# EAGLE design remoteserialcontroller (EAGLE 9.5.2)
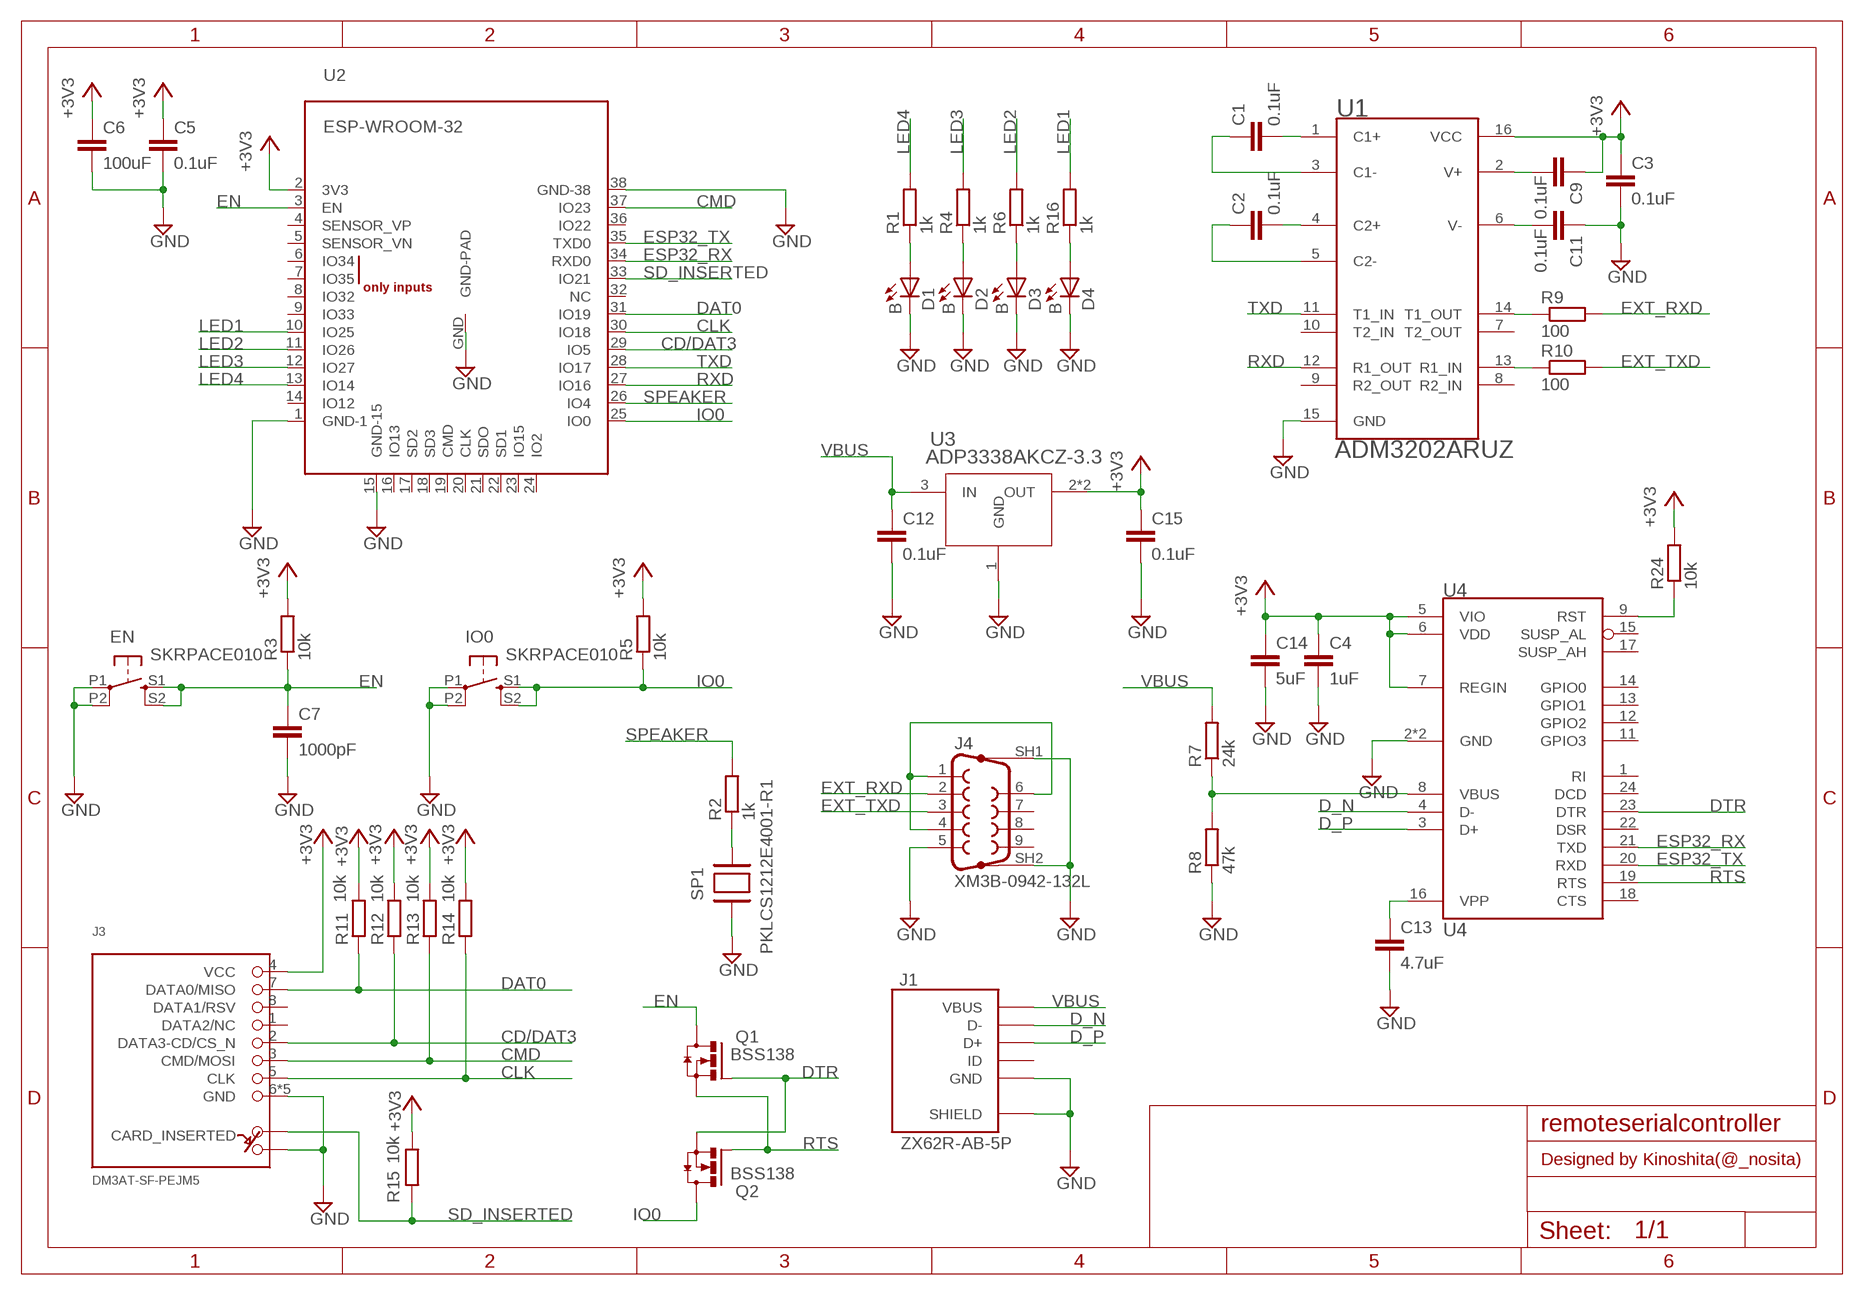
[diagram p0: schematic, sheet 1]

## Parts
C1  0.1uF  C-EUC0603  [C0603]
C2  0.1uF  C-EUC0603  [C0603]
C3  0.1uF  C-EUC0603  [C0603]
C4  1uF  C-EUC0603  [C0603]
C5  0.1uF  C-EUC0603  [C0603]
C6  100uF  C-EUC1210  [C1210]
C7  1000pF  C-EUC0603  [C0603]
C9  0.1uF  C-EUC0603  [C0603]
C11  0.1uF  C-EUC0603  [C0603]
C12  0.1uF  C-EUC0603  [C0603]
C13  4.7uF  C-EUC0603  [C0603]
C14  5uF  C-EUC0603  [C0603]
C15  0.1uF  C-EUC0603  [C0603]
D1  B  LEDCHIPLED_0603  [CHIPLED_0603]
D2  B  LEDCHIPLED_0603  [CHIPLED_0603]
D3  B  LEDCHIPLED_0603  [CHIPLED_0603]
D4  B  LEDCHIPLED_0603  [CHIPLED_0603]
EN  SKRPACE010  [SKRPACE010]
IO0  SKRPACE010  [SKRPACE010]
J1  ZX62R-AB-5P  [ZX62R-B-5PA]
J3  DM3AT-SF-PEJM5  [DM3AT-SF-PEJM5]
J4  XM3B-0942-132L  [XM3B-0942-132L]
Q1  BSS138  [SOT23-N-MOSFET]
Q2  BSS138  [SOT23-N-MOSFET]
R1  1k  R-EU_R0603  [R0603]
R2  1k  R-EU_R0603  [R0603]
R3  10k  R-EU_R0603  [R0603]
R4  1k  R-EU_R0603  [R0603]
R5  10k  R-EU_R0603  [R0603]
R6  1k  R-EU_R0603  [R0603]
R7  24k  R-EU_R0603  [R0603]
R8  47k  R-EU_R0603  [R0603]
R9  100  R-EU_R0603  [R0603]
R10  100  R-EU_R0603  [R0603]
R11  10k  R-EU_R0603  [R0603]
R12  10k  R-EU_R0603  [R0603]
R13  10k  R-EU_R0603  [R0603]
R14  10k  R-EU_R0603  [R0603]
R15  10k  R-EU_R0603  [R0603]
R16  1k  R-EU_R0603  [R0603]
R24  10k  R-EU_R0603  [R0603]
SP1  PKLCS1212E4001-R1  [PKLCS1212E4001-R1]
U1  ADM3202ARUZ  [TSSOP16-AD]
U2  ESP-WROOM-32  [ESP-WROOM-32]
U3  ADP3338AKCZ-3.3  [SOT233]
U4  CP2104  [QFN24-SILABS]

## Nets
+3V3 [POWER]: C3.1 C4.1 C5.1 C6.1 C9.1 C14.1 C15.1 J3.4(VCC) R3.2 R5.2 R11.2 R12.2 R13.2 R14.2 R15.2 R24.2 U1.16(VCC) U2.2(3V3) U3.2(OUT) U3.4(OUT) U4.5(VIO) U4.6(VDD) U4.7(REGIN)
CD/DAT3: J3.2(DATA3-CD/CS_N) R12.1 U2.29(IO5)
CLK: J3.5(CLK) R14.1 U2.30(IO18)
CMD: J3.3(CMD/MOSI) R13.1 U2.37(IO23)
D_N: J1.D- U4.4(D-)
D_P: J1.D+ U4.3(D+)
DAT0: J3.7(DATA0/MISO) R11.1 U2.31(IO19)
DTR: Q1.G Q2.S U4.23(DTR)
EN: C7.1 EN.S1(S) EN.S2(S1) Q1.D R3.1 U2.3(EN)
ESP32_RX: U2.34(RXD0) U4.21(TXD)
ESP32_TX: U2.35(TXD0) U4.20(RXD)
EXT_RXD: J4.2 R9.2
EXT_TXD: J4.3 R10.2
GND: C3.2 C4.2 C5.2 C6.2 C7.2 C11.1 C12.2 C13.2 C14.2 C15.2 D1.C D2.C D3.C D4.C EN.P1(P) EN.P2(P1) IO0.P1(P) IO0.P2(P1) J1.GND J1.SHIELD@1(SHIELD) J1.SHIELD@2(SHIELD) J1.SHIELD@3(SHIELD) J1.SHIELD@4(SHIELD) J3.6(GND) J3.B J3.MOUNT0(GND) J3.MOUNT1(GND) J3.MOUNT2(GND) J3.MOUNT3(GND) J4.5 J4.SH1(G1) J4.SH2(G2) R8.1 SP1.2 U1.15(GND) U2.1(GND-1) U2.15(GND-15) U2.38(GND-38) U2.GND(GND-PAD) U3.1(GND) U4.2(GND) U4.25(GND)
IO0: IO0.S1(S) IO0.S2(S1) Q2.D R5.1 U2.25(IO0)
LED1: R16.2 U2.10(IO25)
LED2: R6.2 U2.11(IO26)
LED3: R4.2 U2.12(IO27)
LED4: R1.2 U2.13(IO14)
N$1: J4.1 J4.4 J4.6
N$2: R9.1 U1.14(T1_OUT)
N$3: R10.1 U1.13(R1_IN)
N$4: D2.A R4.1
N$5: D3.A R6.1
N$6: D4.A R16.1
N$7: R24.1 U4.9(RST)
N$8: R7.1 R8.2 U4.8(VBUS)
N$9: C13.1 U4.16(VPP)
N$11: C1.2 U1.1(C1+)
N$13: C1.1 U1.3(C1-)
N$14: C2.2 U1.4(C2+)
N$15: C2.1 U1.5(C2-)
N$16: C9.2 U1.2(V+)
N$17: C11.2 U1.6(V-)
N$37: R2.1 SP1.1
N$94: D1.A R1.1
RTS: Q1.S Q2.G U4.19(RTS)
RXD: U1.12(R1_OUT) U2.27(IO16)
SD_INSERTED: J3.A R15.1 U2.33(IO21)
SPEAKER: R2.2 U2.26(IO4)
TXD: U1.11(T1_IN) U2.28(IO17)
VBUS: C12.1 J1.VCC(VBUS) R7.2 U3.3(IN)
Unconnected: J1.ID J3.1(DATA2/NC) J3.8(DATA1/RSV) J4.7 J4.8 J4.9 U1.7(T2_OUT) U1.8(R2_IN) U1.9(R2_OUT) U1.10(T2_IN) U2.4(SENSOR_VP) U2.5(SENSOR_VN) U2.6(IO34) U2.7(IO35) U2.8(IO32) U2.9(IO33) U2.14(IO12) U2.16(IO13) U2.17(SD2) U2.18(SD3) U2.19(CMD) U2.20(CLK) U2.21(SDO) U2.22(SD1) U2.23(IO15) U2.24(IO2) U2.32(NC) U2.36(IO22) U4.1(RI) U4.11(GPIO3) U4.12(GPIO2) U4.13(GPIO1) U4.14(GPIO0) U4.15(SUSP_AL) U4.17(SUSP_AH) U4.18(CTS) U4.22(DSR) U4.24(DCD)

## Notes on the sheet
- Designed by Kinoshita(@_nosita)

## Library data of the parts
C1-C7 C9 C11-C15 = taki-library:C-EU: CAPACITOR, European symbol
D1-D4 = taki-library:LED: LED OSRAM: - CHIPLED LG R971, LG N971, LY N971, LG Q971, LY Q971, LO R971, LY R971 LH N974, LH R974 LS Q976, LO Q976, LY Q976 LO Q996 - Hyper CHIPLED LW Q18S LB Q993, LB Q99A, LB R99A - SideLED LS A670, LO A670, LY A670, LG A670, LP A670 LB A673, LV A673, LT A673, LW A673 LH A674 LY A675 LS A676, LA A676, LO A676, LY A676, LW A676 LS A679, LY A679, LG A679 - Hyper Micro SIDELED® LS Y876, LA Y876, LO Y876, LY Y876 LT Y87S - SmartLED LW L88C, LW L88S LB L89C, LB L89S, LG L890 LS L89K, LO L89K, LY L89K LS L896, LA L896, LO L896, LY L896 - TOPLED LS T670, LO T670, LY T670, LG T670, LP T670 LSG T670, LSP T670, LSY T670, LOP T670, LYG T670 LG T671, LOG T671, LSG T671 LB T673, LV T673, LT T673, LW T673 LH T674 LS T676, LA T676, LO T676, LY T676, LB T676, LH T676, LSB T676, LW T676 LB T67C, LV T67C, LT T67C, LS T67K, LO T67K, LY T67K, LW E67C LS E67B, LA E67B, LO E67B, LY E67B, LB E67C, LV E67C, LT E67C LW T67C LS T679, LY T679, LG T679 LS T770, LO T770, LY T770, LG T770, LP T770 LB T773, LV T773, LT T773, LW T773 LH T774 LS E675, LA E675, LY E675, LS T675 LS T776, LA T776, LO T776, LY T776, LB T776 LHGB T686 LT T68C, LB T68C - Hyper Mini TOPLED® LB M676 - Mini TOPLED Santana® LG M470 LS M47K, LO M47K, LY M47K Source: http://www.osram.convergy.de LUXEON: - LUMILED® LXK2-PW12-R00, LXK2-PW12-S00, LXK2-PW14-U00, LXK2-PW14-V00 LXK2-PM12-R00, LXK2-PM12-S00, LXK2-PM14-U00 LXK2-PE12-Q00, LXK2-PE12-R00, LXK2-PE12-S00, LXK2-PE14-T00, LXK2-PE14-U00 LXK2-PB12-K00, LXK2-PB12-L00, LXK2-PB12-M00, LXK2-PB14-N00, LXK2-PB14-P00, LXK2-PB14-Q00 LXK2-PR12-L00, LXK2-PR12-M00, LXK2-PR14-Q00, LXK2-PR14-R00 LXK2-PD12-Q00, LXK2-PD12-R00, LXK2-PD12-S00 LXK2-PH12-R00, LXK2-PH12-S00 LXK2-PL12-P00, LXK2-PL12-Q00, LXK2-PL12-R00 Source: www.luxeon.com KINGBRIGHT: KA-3528ASYC Source: www.kingbright.com
EN IO0 = taki-library:SKRPACE010
J1 = taki-library:ZX62
J3 = taki-library:DM3AT-SF-PEJM5: CONN MICRO SD R/A PUSH-PUSH SMD; DESCRIPTION: CONN MICRO SD CARD PUSH-PUSH R/A; DIGIKEY: HR1964CT-ND; MANUFACTURER: Hirose Electric Co Ltd; MPN: DM3AT-SF-PEJM5
J4 = taki-library:XM3B-0942-132L
Q1 Q2 = taki-library:BSS138
R1-R16 R24 = taki-library:R-EU_: RESISTOR, European symbol
SP1 = taki-library:PKLCS1212E4001-R1
U1 = taki-library:ADM3202ARUZ
U2 = taki-library:ESP-WROOM-32
U3 = taki-library:ADP3338AKCZ-3.3
U4 = taki-library:CP2104

## Net classes
0 default: width 0.152 mm
1 POWER: width 0.254 mm

## Board
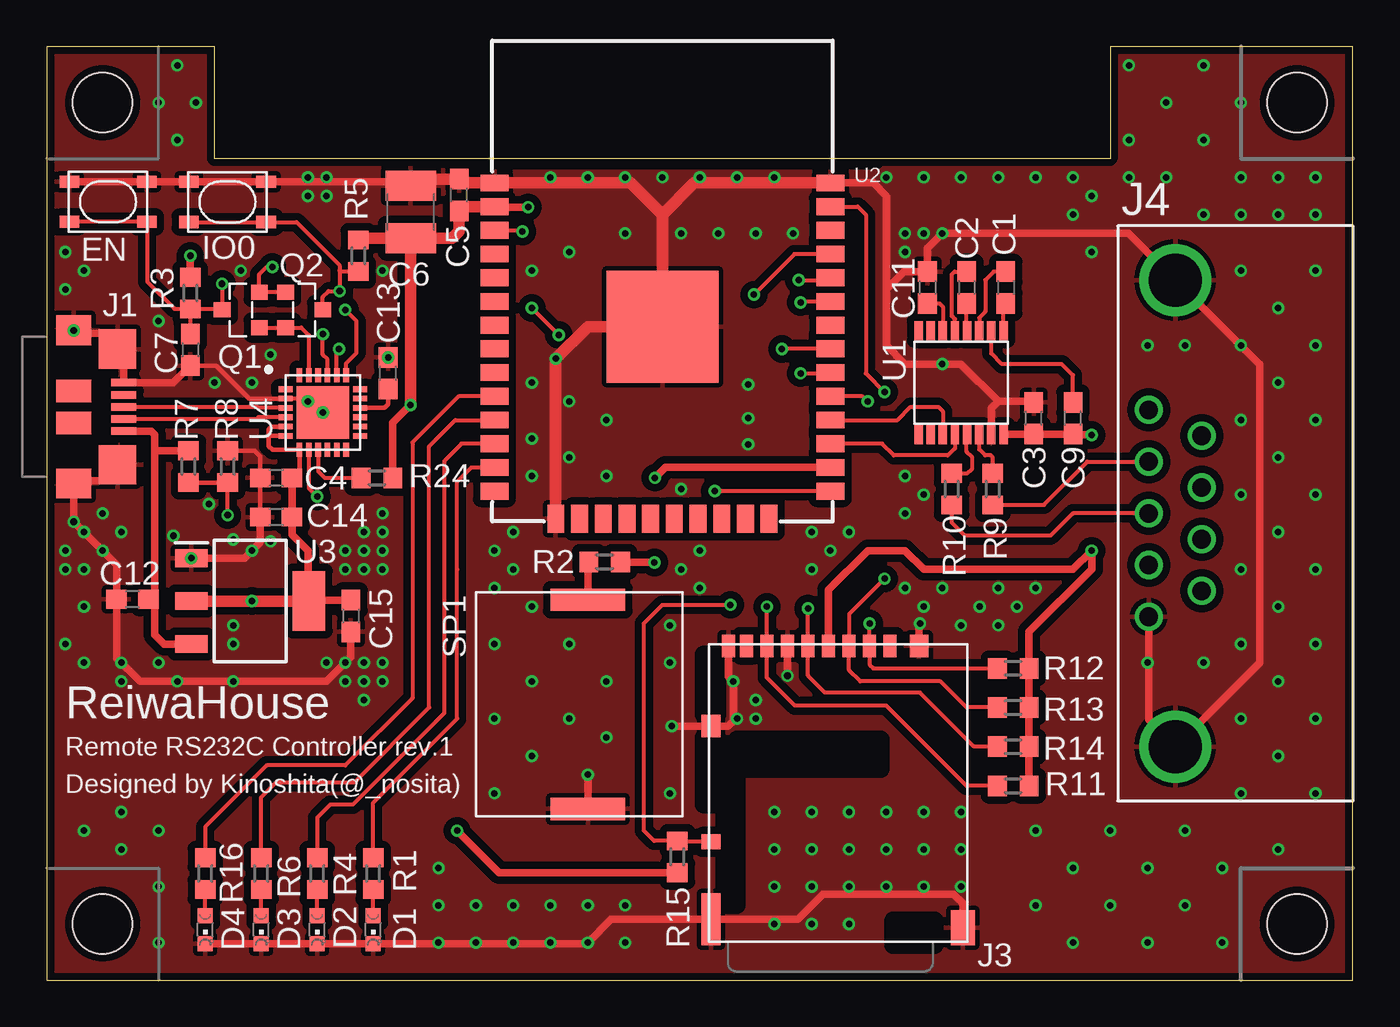
[diagram p1: board, top side]
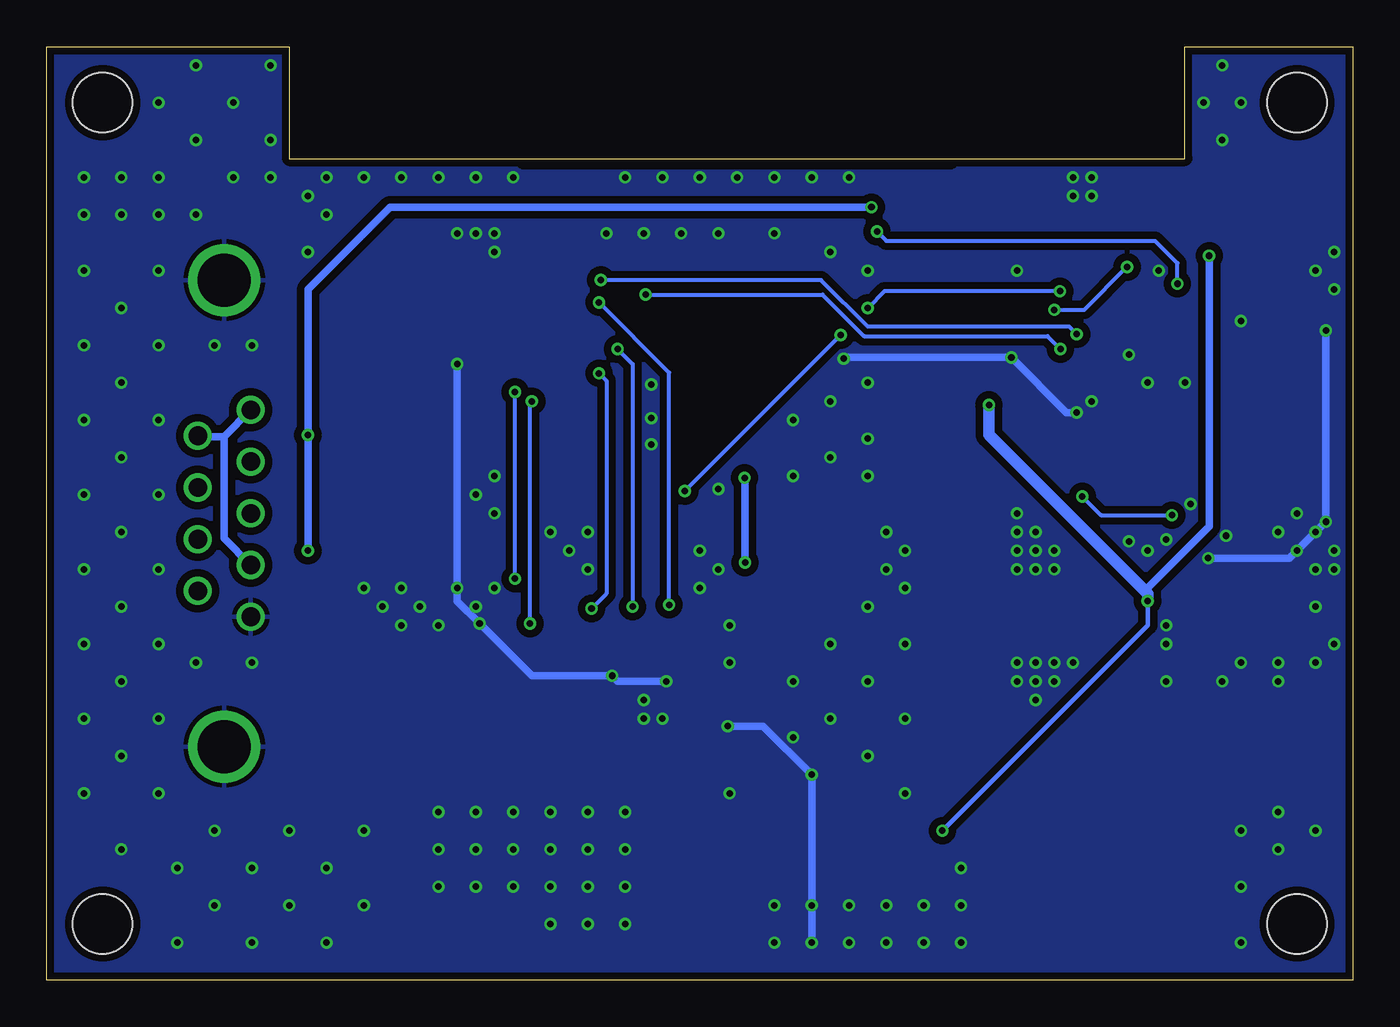
[diagram p2: board, bottom side, seen from below]

Size 70 x 50 mm. Coordinates in mm from the lower left corner, seen from the top.
Outline: 0,0 70,0 70,50 57,50 57,44 9,44 9,50 0,50 0,0
Copper layers (1*16): Top 0.035mm / dielectric 1.5mm / Bottom 0.035mm
Design rules "Elecrow_2-layer_eagle_rule": minimum track width 6mil, minimum drill 12mil, track to track 6mil, track to pad 6mil, pad to pad 6mil, via to via 6mil, smd to smd 0mil, copper to edge 10mil, drill to drill 10mil, minimum pad ring 10mil, minimum via ring 6mil, stop-mask expansion 2mil, vias tented up to drill 100mil, thermal gap 10mil
Holes 3.2 mm at 67,3 67,47 3,47 3,3

### Footprints (pad centres in the part's own frame; a part is rotated, then mirrored left to right if it is on the bottom)
C0603 = smd 1.1 x 1: 1 -0.85,0; 2 0.85,0
C1210 = smd 1.6 x 2.7: 1 -1.4,0; 2 1.4,0
CHIPLED_0603 = smd 0.8 x 0.8: A 0,-0.75; C 0,0.75
SKRPACE010 = smd 1.05 x 0.65: P1 -2.075,-1.075; P2 2.075,-1.075; S1 -2.075,1.075; S2 2.075,1.075
ZX62R-B-5PA = smd 0.4 x 1.35: D+ 0,2.675; D- 0.65,2.675; GND -1.3,2.675; ID -0.65,2.675; VCC 1.3,2.675 | smd 1.2 x 1.9: NC@1 -0.85,0; NC@2 0.85,0 | smd 2.1 x 2: SHIELD@1 -3.1,2.35; SHIELD@2 3.1,2.35 | smd 1.6 x 1.9: SHIELD@3 -4.1,0; SHIELD@4 4.1,0
DM3AT-SF-PEJM5 = smd 0.7 x 1.2: 1 3.2,-0.1; 2 2.1,-0.1; 3 1,-0.1; 4 -0.1,-0.1; 5 -1.2,-0.1; 6 -2.3,-0.1; 7 -3.4,-0.1; 8 -4.5,-0.1; B -5.45,-0.1 | smd 1 x 0.8: A -6.4,-10.6 | smd 1 x 1.2: MOUNT0 4.75,-0.1; MOUNT1 -6.4,-4.4 | smd 1 x 2.8: MOUNT2 -6.4,-14.75 | smd 1.3 x 1.9: MOUNT3 7.1,-15.2
XM3B-0942-132L = drill 1: 1 -5.54,-1.42; 2 -2.77,-1.42; 3 0,-1.42; 4 2.77,-1.42; 5 5.54,-1.42; 6 -4.155,1.42; 7 -1.385,1.42; 8 1.385,1.42; 9 4.155,1.42 | drill 2.84: SH1 -12.495,0; SH2 12.495,0
SOT23-N-MOSFET = smd 0.8 x 0.9: D 0,1; G -0.95,-1; S 0.95,-1
R0603 = smd 1 x 1.1: 1 -0.85,0; 2 0.85,0
PKLCS1212E4001-R1 = smd 1.2 x 4: 1 11.2,0; 2 0,0
TSSOP16-AD = smd 0.45 x 1.05: 1 -2.275,-2.775; 2 -1.625,-2.775; 3 -0.975,-2.775; 4 -0.325,-2.775; 5 0.325,-2.775; 6 0.975,-2.775; 7 1.625,-2.775; 8 2.275,-2.775; 9 2.275,2.775; 10 1.625,2.775; 11 0.975,2.775; 12 0.325,2.775; 13 -0.325,2.775; 14 -0.975,2.775; 15 -1.625,2.775; 16 -2.275,2.775
ESP-WROOM-32 = smd 0.9 x 1.5: 1 7.7,9; 2 6.43,9; 3 5.16,9; 4 3.89,9; 5 2.62,9; 6 1.35,9; 7 0.08,9; 8 -1.19,9; 9 -2.46,9; 10 -3.73,9; 11 -5,9; 12 -6.27,9; 13 -7.54,9; 14 -8.81,9; 25 -8.81,-9; 26 -7.54,-9; 27 -6.27,-9; 28 -5,-9; 29 -3.73,-9; 30 -2.46,-9; 31 -1.19,-9; 32 0.08,-9; 33 1.35,-9; 34 2.62,-9; 35 3.89,-9; 36 5.16,-9; 37 6.43,-9; 38 7.7,-9 | smd 1.5 x 0.9: 15 -10.3,5.715; 16 -10.3,4.445; 17 -10.3,3.175; 18 -10.3,1.905; 19 -10.3,0.635; 20 -10.3,-0.635; 21 -10.3,-1.905; 22 -10.3,-3.175; 23 -10.3,-4.445; 24 -10.3,-5.715 | smd 6 x 6: GND 0,0
SOT233 = smd 1.75 x 0.95: 1 -3.15,2.3; 2 -3.15,0; 3 -3.15,-2.3 | smd 1.75 x 3.2: 4 3.15,0
QFN24-SILABS = smd 0.75 x 0.3: 1 -2,1.25; 2 -2,0.75; 3 -2,0.25; 4 -2,-0.25; 5 -2,-0.75; 6 -2,-1.25; 13 2,-1.25; 14 2,-0.75; 15 2,-0.25; 16 2,0.25; 17 2,0.75; 18 2,1.25 | smd 0.3 x 0.75: 7 -1.25,-2; 8 -0.75,-2; 9 -0.25,-2; 10 0.25,-2; 11 0.75,-2; 12 1.25,-2; 19 1.25,2; 20 0.75,2; 21 0.25,2; 22 -0.25,2; 23 -0.75,2; 24 -1.25,2 | smd 2.8 x 2.8: 25 0,0

### Placement (x,y rotation side)
C1  51.4,37.1 270 top
C2  49.3,37.1 270 top
C3  52.9,30.1 90 top
C4  12.3,26.9 180 top
C5  22.11,42.05 90 top
C6  19.51,41.14 90 top
C7  7.7,33.76 270 top
C9  55,30.1 90 top
C11  47.2,37.1 270 top
C12  4.6,20.4 180 top
C13  18.3,32.5 90 top
C14  12.3,24.8 180 top
C15  16.3,19.5 270 top
D1  17.5,2.7 180 top
D2  14.5,2.7 180 top
D3  11.5,2.7 180 top
D4  8.5,2.7 180 top
EN  3.29,41.69 180 top
IO0  9.69,41.68 180 top
J1  1.45,30.7 270 top
J3  42,18 0 top
J4  60.48,25 270 top
Q1  10.4,35.9 90 top
Q2  13.8,35.9 270 top
R1  17.5,5.7 90 top
R2  29.9,22.4 0 top
R3  7.7,36.8 90 top
R4  14.5,5.7 90 top
R5  16.7,38.8 90 top
R6  11.5,5.7 90 top
R7  7.6,27.5 90 top
R8  9.7,27.5 270 top
R9  50.7,26.3 270 top
R10  48.5,26.3 270 top
R11  51.8,10.4 0 top
R12  51.8,16.7 0 top
R13  51.8,14.6 0 top
R14  51.8,12.5 0 top
R15  33.8,6.6 270 top
R16  8.5,5.7 90 top
R24  17.7,26.9 0 top
SP1  29,9.17 90 top
U1  49,32 180 top
U2  33,35 90 top
U3  10.9,20.3 0 top
U4  14.8,30.4 0 top

### Tracks (layer width: path | path; a pad name or v marks a point on that pad's centre or on a via)
+3V3  (via drill 0.35)
  Top 0.254: U4.5 12.05,29.65 11.9,29.5 11.9,29.1 | 11.9,29.1 11.9,28.6 12.1,28.4 U4.7 13.55,27.3 C4.1 | U4.6 11.95,29.15 11.9,29.1
  Top 0.406: C9.1 54.98,29.23 | C9.1 C3.1 52.88,29.23 U1.16 | R11.2 R14.2 R13.2 R12.2 52.65,18.65 56,22 v56,23 55,22 47,22 46,23 44,23 41.9,20.9 J3.4 | v56,29.2 55.05,29.2 C9.1 | C4.1 C14.1 13.15,23.85 14,23 14,20.35 | R3.2 v7.7,38.8 | U3.4 14,20.35 | C15.1 14,20.35 | R15.2 24.25,5.75 v22,8 | v25.8,41.4 24.03,41.4 U2.2 | R24.2 18.55,29.85 v19.51,30.81
  Top 0.61: U2.2 22.27,41.43 C5.1 22.11,40.11 21.74,39.74 C6.1 | C6.1 16.79,39.74 R5.2 | C6.1 19.51,36 v19.51,30.81 v19.5,30.8 | U3.4 v11,20.3 U3.2
  Bottom 0.254: v22,8 11,19 v11,20.3
  Bottom 0.406: v56,23 v56,29.2 56,37 51.6,41.4 v25.8,41.4 | 11.15,20.85 7.7,24.3 v7.7,38.8
  Bottom 0.61: v19.5,30.8 19.5,29.2 11.15,20.85 11,20.7 v11,20.3
CD/DAT3  (via drill 0.35)
  Top 0.203: R12.1 44.3,16.7 44.1,16.9 J3.2 v44.1,19.1 | v44,31 43.73,31.27 U2.29
  Bottom 0.203: v44.1,19.1 44.1,30.9 v44,31
CLK  (via drill 0.35)
  Top 0.203: R14.1 49.7,12.5 46.8,15.4 41.7,15.4 40.8,16.3 J3.5 v40.8,19.9 | v40.4,32.5 41.96,32.5 U2.30
  Bottom 0.203: v40.4,32.5 40,32.1 40,20.7 v40.8,19.9
CMD  (via drill 0.35)
  Top 0.203: R13.1 49.3,14.6 47.9,16 43.6,16 43,16.6 J3.3 43,19.6 v44.9,21.5 | U2.37 43.47,41.43 43.9,41 43.9,32.5 v44.9,31.5
  Bottom 0.203: v44.9,21.5 v44.9,31.5
D_N
  Top 0.203: U4.4 11.35,30.15 11.25,30.05 J1.D-
D_P
  Top 0.203: U4.3 11.35,30.65 11.3,30.7 J1.D+
DAT0  (via drill 0.35)
  Top 0.203: R11.1 49.3,10.4 45,14.7 40.1,14.7 38.6,16.2 J3.7 v38.6,20 | U2.31 v39.41,33.81 v39.4,33.8
  Bottom 0.203: v39.4,33.8 38.6,33 v38.6,20
DTR
  Top 0.203: Q1.G Q2.S 13.65,34.95 14.05,34.55 U4.23
EN  (via drill 0.35)
  Top 0.203: U2.3 25.44,40.16 v25.5,40.1 | v9.4,37.3 Q1.D 9.35,35.95 R3.1 | R3.1 C7.1 | R3.1 6.85,35.95 5.4,37.4 5.4,40.58 EN.S1 EN.S2
  Bottom 0.203: v25.5,40.1 25,39.6 10.6,39.6 9.4,38.4 v9.4,37.3
ESP32_RX  (via drill 0.35)
  Top 0.203: U4.21 15.05,33.25 14.8,33.5 v14.8,34.6 | v40.3,37.5 41.88,37.5 U2.34
  Bottom 0.203: v14.8,34.6 15.2,35 26,35 28.5,37.5 v40.3,37.5
ESP32_TX  (via drill 0.35)
  Top 0.203: U4.20 15.55,33.68 v15.67,33.8 | U2.35 40.07,38.89 v37.9,36.72
  Bottom 0.203: v15.67,33.8 16.37,34.5 26.2,34.5 28.42,36.72 v37.9,36.72
EXT_RXD
  Top 0.203: R9.2 53.45,25.45 55.77,27.77 J4.2
EXT_TXD
  Top 0.203: R10.2 48.5,24.5 49.2,23.8 53.8,23.8 55,25 J4.3
GND  (via drill 0.35)
  Top 0.203: U4.2 13.85,31.15 14.6,30.4 U4.25 | 18.65,33 C13.2
  Top 0.254: C14.2 11.45,25 C4.2 11.45,28.05 11.15,28.35 R8.1 | U4.2 10.85,31.15 9.09,32.91 C7.2
  Top 0.406: U1.15 50.62,30.62 51,31 | 51,31 52.85,31 C3.2 | 51,31 49,33 v48,33 46,33 45,34 45,37 | 45,37 45.95,37.95 C11.1 47.2,39.2 v48,40 57.98,40 J4.SH1 64.97,33 65,33 65,17 60.51,12.51 | 19.94,42.97 C6.2 19.3,42.76 IO0.P1 IO0.P2 EN.P1 EN.P2 | J3.MOUNT3 49.1,4.1 48.6,4.6 41.6,4.6 40.25,3.25 J3.MOUNT2 30.25,3.25 v29,2 28.95,1.95 D1.C D2.C D3.C D4.C | J3.B 36.55,16.25 v36.8,16 36.8,13.9 36.5,13.6 J3.MOUNT1 v33.5,13.6 | J3.6 v39.7,16.3 | J3.MOUNT0 46.75,19.05 v46.8,19.1 | J4.SH2 60.51,12.51 | J4.5 59.06,13.95 60.51,12.51 | 45,37 45,42 44.3,42.7 U2.38 | J1.SHIELD@1 4,34 4.12,33.88 J1.GND 6.79,32 C7.2 | J1.SHIELD@1 4.09,34.09 3.65,34.53 | J1.SHIELD@2 3.65,27.45 3.65,26.87 3.53,26.75 1.6,26.75 J1.SHIELD@4 v1.45,24.55 3.75,22.25 C12.2 3.75,17.25 5,16 15,16 16.3,17.3 C15.2 | 29,9 SP1.2 v29,11 | U3.1 10.6,22.6 11.45,23.45 11.45,25 | 3.65,34.53 3.53,34.65 1.3,34.65 | J1.SHIELD@1 3.65,33.95 3.65,34.53 | J1.SHIELD@3 1.3,34.65 | 1.3,34.65 1,34.65
  Top 0.61: C6.2 19.87,42.9 C5.2 22.38,42.7 U2.1 31.3,42.7 33,41 | 33,41 U2.GND 29,35 v27.29,33.28 U2.15 | U2.38 34.7,42.7 33,41
  Bottom 0.406: v36.8,16 39.4,16 v39.7,16.3 44,16.3 v46.8,19.1 48,20.3 v48,33 | v33.5,13.6 31.6,13.6 v29,11 v29,2 | U3.1 3.4,22.6 v1.45,24.55 J1.SHIELD@3 | U4.25 15.35,30.4 C13.2 27.22,33.35 v27.29,33.28
  other vias: 7.75,22.6 14.8,30.4 18.3,33.35 1.45,34.8 7,49 8,47 7,45 6,47 1,37 15,43 1,39 9,32 11,32 14,31 18,38 24,23 25,22 24,21 24,10 26,12 24,14 28,14 26,16 28,18 24,18 26,20 30,16 30,13 34,22 26,32 28,31 26,29 28,28 30,27 30,30 37.6,31.9 37.6,30.1 37.6,28.7 26,38 28,39 31,40 34,40 36,40 38,40 40,40 27,43 29,43 31,43 33,43 35,43 37,43 39,43 45,43 47,43 49,43 51,43 53,43 55,43 58,43 58,49 60,47 58,45 62,49 62,45 60,43 62,41 64,43 66,41 68,43 66,43 68,41 64,41 64,47 64,38 66,36 68,38 68,34 64,34 66,32 68,30 64,30 66,28 68,26 64,26 66,24 68,22 64,22 66,20 68,18 64,18 66,16 68,14 64,14 66,12 64,10 68,10 66,7 39,9 39,7 39,5 41,9 41,7 41,5 43,5 43,7 43,9 45,9 45,7 45,5 47,5 47,7 47,9 49,9 49,7 49,5 39,3 41,3 43,3 21,6 21,4 21,2 23,4 23,2 25,4 25,2 27,4 27,2 29,4 31,4 31,2 2,8 4,9 6,8 4,7 6,5 6,2 1,18 2,20 1,22 2,24 4,24 11,23 6.8,23.8 6,35.3 12,33.5 2,38 14,43 14,42 15,42 17,24 18,24 18,23 17,23 17,22 18,22 16,23 18,25 25,24 10,23.6 12,23.5 8.7,25.5 10,19 10,18 3,25 3,23 1,23 2,22 10.4,38 33.4,19 33.4,17 33.4,10 38,14 37,14 38,15 48,21 51,21 50,20 49,19 47,20 53,21 52,20 51,19 46,21 46,27 47,26 46,25 41,24 42,23 43,24 41,22 35,23 35,21 34,26.3 46,40 47,40 46,39 55,41 56,42 56,39 59,34 61,34 59,17 62,17 53,8 55,6 53,4 55,2 57,4 57,8 59,6 59,2 61,4 61,8 63,6 63,2 10,16 7,16 4,16 2,17 4,17 6,17 15,17 18,17 17,16 17,15 18,16 17,17 16,17 16,16 16,22 26,27
  pour Bottom (isolate 0.4): -1,50 -1,0 70,0 70,50
  pour Top (isolate 0.4): -2,50 -2,0 70,0 70,50
IO0  (via drill 0.35)
  Top 0.203: U2.25 v35.81,26.19 v35.8,26.2 | IO0.S2 IO0.S1 13.39,40.6 15.7,38.3 15.7,38 | 15.7,38 15.7,37 | 15.7,37 v15.7,36.9 15.1,36.9 14.8,36.6 Q2.D | 15.75,37 15.7,37 | R5.1 15.75,37.95 15.7,38 | v27.45,34.55 v26,36
  Bottom 0.203: v35.8,26.2 v27.45,34.55 | v15.7,36.9 25.1,36.9 v26,36
LED1
  Top 0.203: U2.10 22.07,31.27 19.6,28.8 19.6,15.1 16,11.5 11.8,11.5 8.5,8.2 R16.2
LED2
  Top 0.203: R6.2 11.5,9.8 12.3,10.6 16.5,10.6 20.5,14.6 20.5,28.6 21.9,30 U2.11
LED3
  Top 0.203: U2.12 22.23,28.73 21.3,27.8 21.3,14.3 16.4,9.4 15.2,9.4 14.5,8.7 R4.2
LED4
  Top 0.203: R1.2 17.5,9.5 22,14 22,22 22,26.7 22.76,27.46 U2.13
N$1
  Bottom 0.406: J4.4 60.5,23.67 60.5,29.1 | 60.5,29.1 J4.1 | J4.6 61.84,29.1 60.5,29.1
N$2
  Top 0.203: R9.1 50.7,28 50.6,28.1 50.3,28.1 49.98,28.43 U1.14
N$3
  Top 0.203: R10.1 49.35,27.15 49.6,27.4 49.6,28 49.3,28.3 49.3,29.2 U1.13
N$4
  Top 0.203: D2.A R4.1
N$5
  Top 0.203: D3.A R6.1
N$6
  Top 0.203: D4.A R16.1
N$7
  Top 0.203: U4.9 14.55,27.25 14.9,26.9 R24.1
N$8  (via drill 0.35)
  Top 0.203: v9.7,24.9 R8.2 | U4.8 14.05,26.35 v14.5,25.9
  Top 0.254: R7.1 R8.2
  Bottom 0.203: v14.5,25.9 13.5,24.9 v9.7,24.9
N$9
  Top 0.203: U4.16 17,30.65
  Top 0.254: C13.1 18.3,30.85 18.1,30.65 17,30.65
N$11
  Top 0.152: 51.27,36.12 C1.2
  Top 0.203: U1.1 51.27,36.12
N$13
  Top 0.203: C1.1 50.75,37.95 50.3,37.5 50.3,35.8 49.98,35.48 U1.3
N$14
  Top 0.152: U1.4 49.3,34.8
  Top 0.203: 49.3,34.8 C2.2
N$15
  Top 0.203: U1.5 48.67,35.4 48.5,35.58 48.5,37.8 48.65,37.95 C2.1
N$16
  Top 0.203: C9.2 55,32.4 54.4,33 51.2,33 50.62,33.58 U1.2
N$17
  Top 0.203: C11.2 47.85,36.25 48.02,36.08 U1.6
N$37
  Top 0.406: SP1.1 29,22.35 R2.1
N$94
  Top 0.203: D1.A R1.1
RTS  (via drill 0.35)
  Top 0.203: Q2.G Q1.S 11.4,37.8 11.8,38.2 v12.1,38.2 | 16.05,35.85 v16,35.9 16.6,35.3 16.6,33.6 16.05,33.05 U4.19
  Bottom 0.203: v16,35.9 14.4,35.9 v12.1,38.2
RXD
  Top 0.203: U1.12 48.67,28.48 48.3,28.1 45.4,28.1 44.77,28.73 U2.27
SD_INSERTED  (via drill 0.35)
  Top 0.203: J3.A 33.85,7.4 R15.1 32.55,7.45 32,8 32,19.1 33,20.1 v36.64,20.1 | v40.4,36.3 40.45,36.35 U2.33
  Bottom 0.203: v36.64,20.1 36.64,32.54 v40.4,36.3
SPEAKER  (via drill 0.35)
  Top 0.406: v32.6,26.9 33.16,27.46 U2.26 | R2.2 30.78,22.37 v32.57,22.37
  Bottom 0.406: v32.57,22.37 32.57,26.87 v32.6,26.9
TXD
  Top 0.203: U1.11 48.02,30.48 47.8,30.7 46.3,30.7 45.6,30 U2.28
VBUS
  Top 0.406: J1.VCC 5.6,29.4 5.8,29.2 5.8,28.3 | R7.2 5.85,28.35 5.8,28.3 | U3.3 6.3,18 5.8,18.5 5.8,20.5 | 5.8,20.5 5.8,28.3 | C12.1 5.55,20.5 5.8,20.5

### Text on the board
tPlace: ReiwaHouse | Remote RS232C Controller rev.1 | Designed by Kinoshita(@_nosita)